# EAGLE schematic stereomix-back (EAGLE 9.0.1)
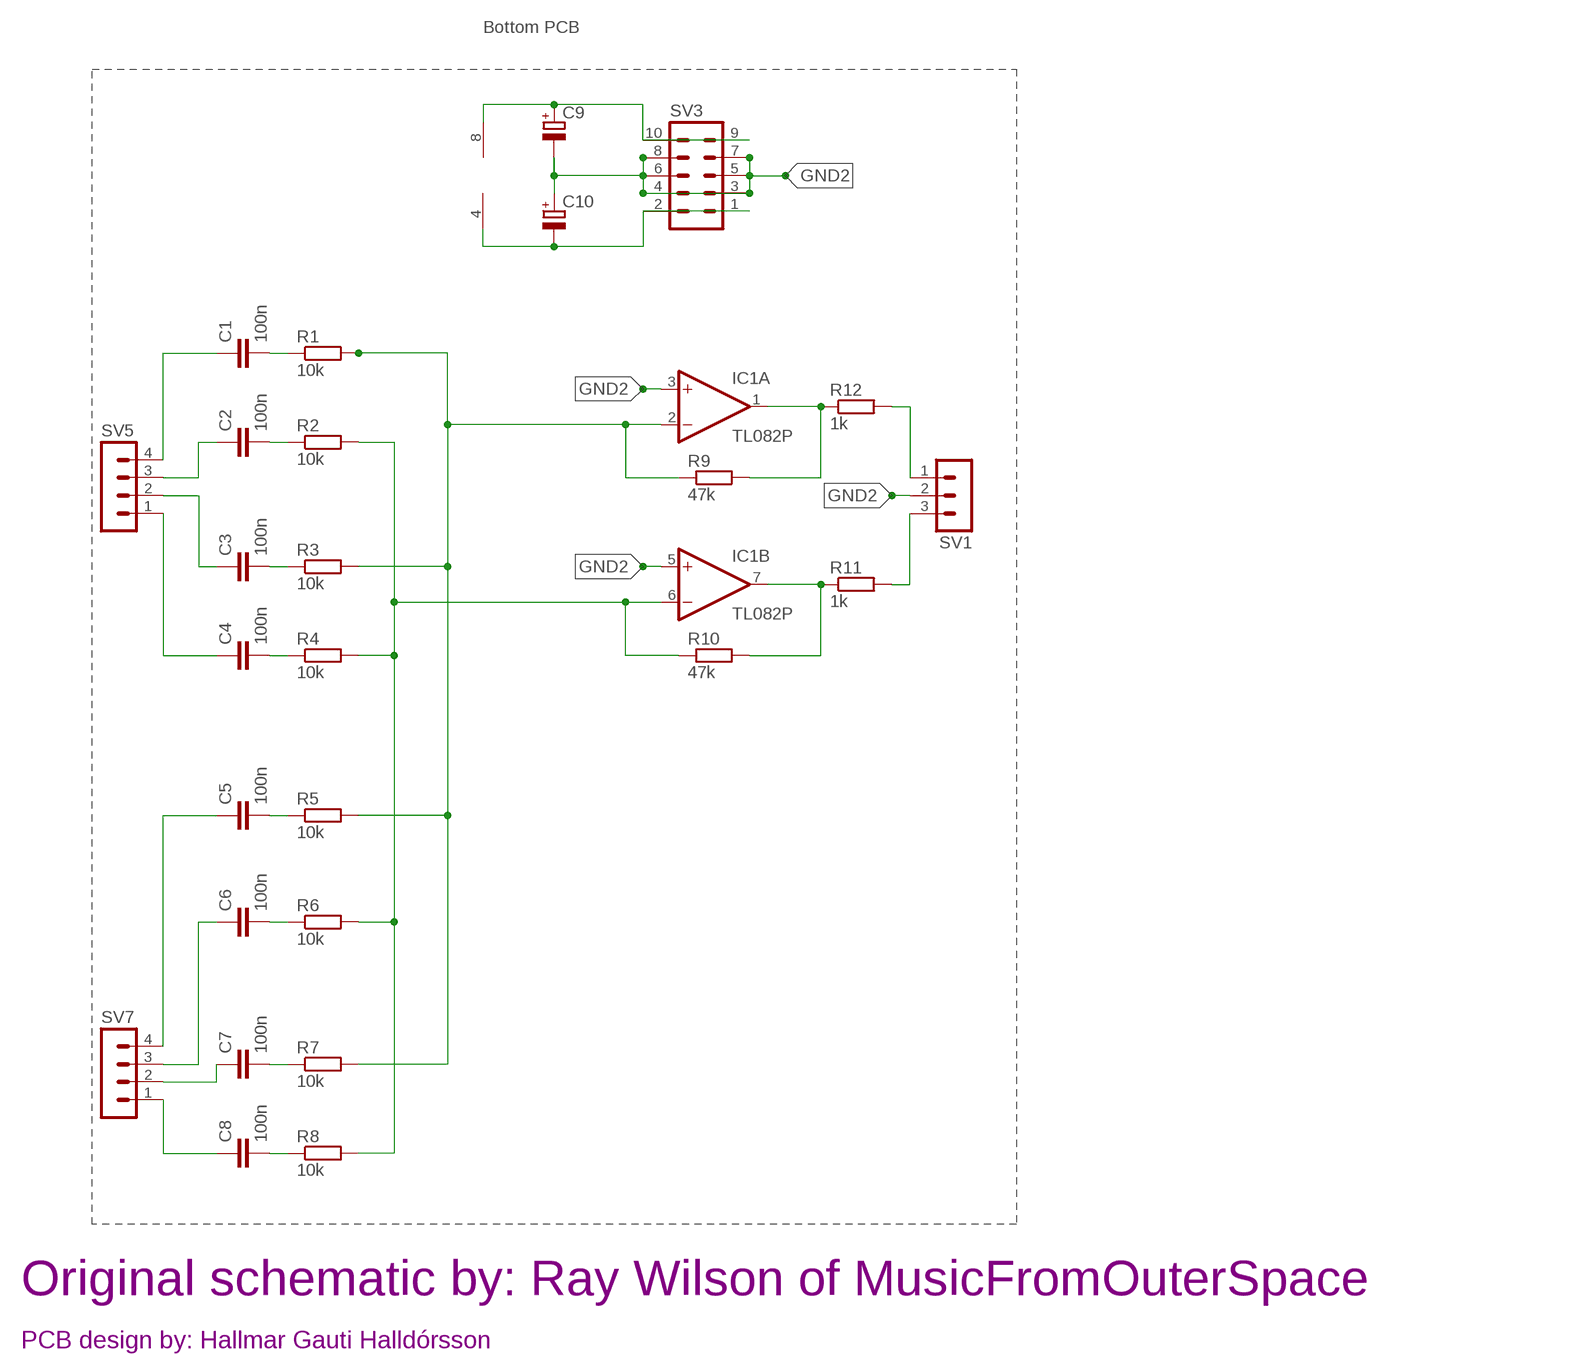
[diagram p0: schematic, sheet 1]

## Parts
C1  100n  C-EU050-024X044  [C050-024X044]
C2  100n  C-EU050-024X044  [C050-024X044]
C3  100n  C-EU050-024X044  [C050-024X044]
C4  100n  C-EU050-024X044  [C050-024X044]
C5  100n  C-EU050-024X044  [C050-024X044]
C6  100n  C-EU050-024X044  [C050-024X044]
C7  100n  C-EU050-024X044  [C050-024X044]
C8  100n  C-EU050-024X044  [C050-024X044]
C9  CPOL-EUE2.5-6  [E2,5-6]
C10  CPOL-EUE2,5-6E  [E2,5-6E]
IC1  TL082P  [DIL08]
R1  10k  R-EU_0204/7  [0204/7]
R2  10k  R-EU_0204/7  [0204/7]
R3  10k  R-EU_0204/7  [0204/7]
R4  10k  R-EU_0204/7  [0204/7]
R5  10k  R-EU_0204/7  [0204/7]
R6  10k  R-EU_0204/7  [0204/7]
R7  10k  R-EU_0204/7  [0204/7]
R8  10k  R-EU_0204/7  [0204/7]
R9  47k  R-EU_0204/7  [0204/7]
R10  47k  R-EU_0204/7  [0204/7]
R11  1k  R-EU_0204/7  [0204/7]
R12  1k  R-EU_0204/7  [0204/7]
SV1  MA03-1  [MA03-1]
SV3  MA05-2  [MA05-2]
SV5  MA04-1  [MA04-1]
SV7  MA04-1  [MA04-1]

## Nets
GND2: C9.- C10.+ IC1.3(A:+IN) IC1.5(B:+IN) SV1.2 SV3.3 SV3.4 SV3.5 SV3.6 SV3.7 SV3.8
N$1: IC1.2(A:-IN) R1.2 R3.2 R5.2 R7.2 R9.1
N$2: IC1.1(A:OUT) R9.2 R12.1
N$3: IC1.7(B:OUT) R10.2 R11.1
N$4: IC1.6(B:-IN) R2.2 R4.2 R6.2 R8.2 R10.1
N$5: R12.2 SV1.1
N$6: C1.2 R1.1
N$7: C2.2 R2.1
N$8: C3.2 R3.1
N$9: C4.2 R4.1
N$10: C5.2 R5.1
N$11: C6.2 R6.1
N$12: C7.2 R7.1
N$13: C8.2 R8.1
N$14: R11.2 SV1.3
N$15: C9.+ IC1.8(P:V+) SV3.9 SV3.10
N$16: C10.- IC1.4(P:V-) SV3.1 SV3.2
N$35: C8.1 SV7.1
N$36: C7.1 SV7.2
N$37: C6.1 SV7.3
N$38: C5.1 SV7.4
N$39: C4.1 SV5.1
N$40: C3.1 SV5.2
N$41: C2.1 SV5.3
N$42: C1.1 SV5.4

## Notes on the sheet
- Bottom PCB
- Original schematic by: Ray Wilson of MusicFromOuterSpace
- PCB design by: Hallmar Gauti Halldórsson

## Library data of the parts
C1-C8 = resistor:C-EU: CAPACITOR, European symbol
C9 C10 = resistor:CPOL-EU: POLARIZED CAPACITOR, European symbol
IC1 = linear:TL082: OP AMP
R1-R12 = resistor:R-EU_: RESISTOR, European symbol
SV1 = con-lstb:MA03-1: PIN HEADER; OC_FARNELL: unknown; OC_NEWARK: unknown
SV3 = con-lstb:MA05-2: PIN HEADER; OC_FARNELL: unknown; OC_NEWARK: unknown
SV5 SV7 = con-lstb:MA04-1: PIN HEADER; OC_FARNELL: unknown; OC_NEWARK: unknown